# Altium schematic sheet BLOCK DIAGRAM.SchDoc
size A3; SheetNumber: 1; SheetTotal: 7
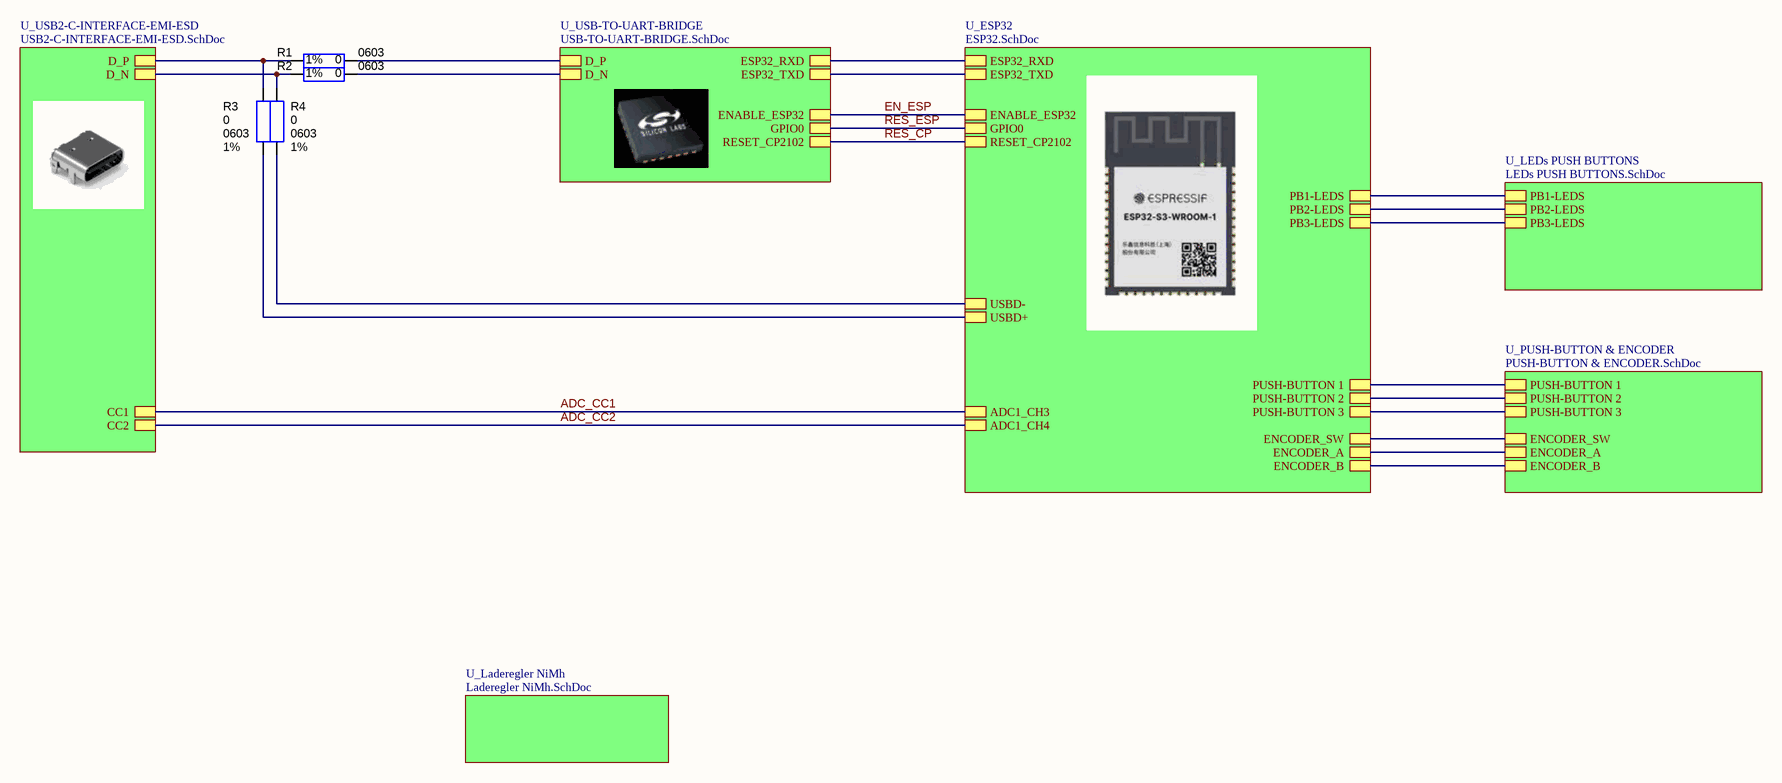
[diagram p0: BLOCK DIAGRAM.SchDoc]

## Parts
R1  value 0  Case/Package: 0603  Tolerance: 1%  [RESC0603X21L]  (hidden comment: RC0603FR-070RL)
R2  value 0  Case/Package: 0603  Tolerance: 1%  [RESC0603X21L]  (hidden comment: RC0603FR-070RL)
R3  value 0  Case/Package: 0603  Tolerance: 1%  [RESC0603X21L]  (hidden comment: RC0603FR-070RL)
R4  value 0  Case/Package: 0603  Tolerance: 1%  [RESC0603X21L]  (hidden comment: RC0603FR-070RL)

## Sub-sheets
U_ESP32 = ESP32.SchDoc: ESP32_RXD, ESP32_TXD, USBD-, USBD+, RESET_CP2102, ENABLE_ESP32, GPIO0, ADC1_CH3, ADC1_CH4, PUSH-BUTTON 1, PUSH-BUTTON 2, PUSH-BUTTON 3, ENCODER_SW, PB1-LEDS, PB2-LEDS, PB3-LEDS, ENCODER_A, ENCODER_B
U_Laderegler NiMh = Laderegler NiMh.SchDoc: no entries
U_LEDs PUSH BUTTONS = LEDs PUSH BUTTONS.SchDoc: PB1-LEDS, PB2-LEDS, PB3-LEDS
U_PUSH-BUTTON & ENCODER = PUSH-BUTTON & ENCODER.SchDoc: PUSH-BUTTON 1, PUSH-BUTTON 2, PUSH-BUTTON 3, ENCODER_SW, ENCODER_A, ENCODER_B
U_USB2-C-INTERFACE-EMI-ESD = USB2-C-INTERFACE-EMI-ESD.SchDoc: D_P, D_N, CC1, CC2
U_USB-TO-UART-BRIDGE = USB-TO-UART-BRIDGE.SchDoc: ESP32_RXD, ESP32_TXD, D_P, D_N, ENABLE_ESP32, GPIO0, RESET_CP2102

## Nets
ADC_CC1: sheet U_ESP32/ADC1_CH3, sheet U_USB2-C-INTERFACE-EMI-ESD/CC1
ADC_CC2: sheet U_ESP32/ADC1_CH4, sheet U_USB2-C-INTERFACE-EMI-ESD/CC2
EN_ESP: sheet U_ESP32/ENABLE_ESP32, sheet U_USB-TO-UART-BRIDGE/ENABLE_ESP32
RES_CP: sheet U_ESP32/RESET_CP2102, sheet U_USB-TO-UART-BRIDGE/RESET_CP2102
RES_ESP: sheet U_ESP32/GPIO0, sheet U_USB-TO-UART-BRIDGE/GPIO0
NetR1_1: R1.1 R3.2 ; sheet U_USB2-C-INTERFACE-EMI-ESD/D_P
NetR1_2: R1.2 ; sheet U_USB-TO-UART-BRIDGE/D_P
NetR2_1: R2.1 R4.2 ; sheet U_USB2-C-INTERFACE-EMI-ESD/D_N
NetR2_2: R2.2 ; sheet U_USB-TO-UART-BRIDGE/D_N
NetR3_1: R3.1 ; sheet U_ESP32/USBD+
NetR4_1: R4.1 ; sheet U_ESP32/USBD-
(unnamed): sheet U_ESP32/ESP32_RXD, sheet U_USB-TO-UART-BRIDGE/ESP32_RXD
(unnamed): sheet U_ESP32/ESP32_TXD, sheet U_USB-TO-UART-BRIDGE/ESP32_TXD
(unnamed): sheet U_ESP32/PUSH-BUTTON 1, sheet U_PUSH-BUTTON & ENCODER/PUSH-BUTTON 1
(unnamed): sheet U_ESP32/PUSH-BUTTON 2, sheet U_PUSH-BUTTON & ENCODER/PUSH-BUTTON 2
(unnamed): sheet U_ESP32/PUSH-BUTTON 3, sheet U_PUSH-BUTTON & ENCODER/PUSH-BUTTON 3
(unnamed): sheet U_ESP32/ENCODER_SW, sheet U_PUSH-BUTTON & ENCODER/ENCODER_SW
(unnamed): sheet U_ESP32/PB1-LEDS, sheet U_LEDs PUSH BUTTONS/PB1-LEDS
(unnamed): sheet U_ESP32/PB2-LEDS, sheet U_LEDs PUSH BUTTONS/PB2-LEDS
(unnamed): sheet U_ESP32/PB3-LEDS, sheet U_LEDs PUSH BUTTONS/PB3-LEDS
(unnamed): sheet U_ESP32/ENCODER_A, sheet U_PUSH-BUTTON & ENCODER/ENCODER_A
(unnamed): sheet U_ESP32/ENCODER_B, sheet U_PUSH-BUTTON & ENCODER/ENCODER_B

## Notes on the sheet
- Project
- Schematic Sheet
- EDATRON Solutions GmbH
- Engineering | Training | Consulting
- www.edatron-solutions.com <http://www.edatron-solutions.com>
- Assembly Variant
- Drawn
- Date
- Checked
- Approved
- Project Number
- Customer
- Version/ Revisionindex
- Sheet
- /
- Contact Person
- Name:
- E-Mail:
- Phone:

## Library data of the parts
R1-R4 = CMP-009-00178-12: RESISTOR 0R 1% 0603 100mW; Manufacturer 1: Yageo; Comment Designer: can be substituted same values other manufacturers; Manufacturer 1 Part Number: RC0603FR-070RL; Power: 100mW; Operating Temperature (min): -55°C; Operating Temperature (max): 125°C